# EAGLE design huskylens_servo (EAGLE 9.2.2)
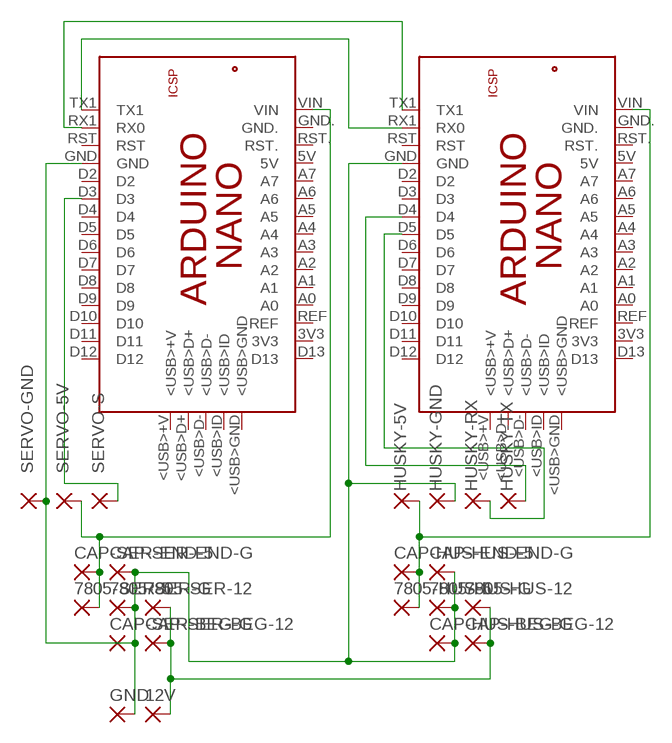
[diagram p0: schematic, sheet 1]

## Parts
12V  2,15/1,0  [2,15/1,0]
7805-HUS-5  2,15/1,0  [2,15/1,0]
7805-HUS-12  2,15/1,0  [2,15/1,0]
7805-HUS-G  2,15/1,0  [2,15/1,0]
7805-SER-5  2,15/1,0  [2,15/1,0]
7805-SER-12  2,15/1,0  [2,15/1,0]
7805-SER-G  2,15/1,0  [2,15/1,0]
CAP-HUS-BEG-12  2,15/1,0  [2,15/1,0]
CAP-HUS-BEG-G  2,15/1,0  [2,15/1,0]
CAP-HUS-END-5  2,15/1,0  [2,15/1,0]
CAP-HUS-END-G  2,15/1,0  [2,15/1,0]
CAP-SER-BEG-12  2,15/1,0  [2,15/1,0]
CAP-SER-BEG-G  2,15/1,0  [2,15/1,0]
CAP-SER-END-5  2,15/1,0  [2,15/1,0]
CAP-SER-END-G  2,15/1,0  [2,15/1,0]
GND  2,15/1,0  [2,15/1,0]
HUSKY-5V  2,15/1,0  [2,15/1,0]
HUSKY-ARD  ARDUINO_NANO  [ARDUINO_NANO]
HUSKY-GND  2,15/1,0  [2,15/1,0]
HUSKY-RX  2,15/1,0  [2,15/1,0]
HUSKY-TX  2,15/1,0  [2,15/1,0]
SERVO-5V  2,15/1,0  [2,15/1,0]
SERVO-ARD  ARDUINO_NANO  [ARDUINO_NANO]
SERVO-GND  2,15/1,0  [2,15/1,0]
SERVO-S  2,15/1,0  [2,15/1,0]

## Nets
N$1: HUSKY-ARD.RX1(RX0) SERVO-ARD.TX1
N$2: HUSKY-ARD.TX1 SERVO-ARD.RX1(RX0)
N$3: 7805-HUS-G.1(P) 7805-SER-G.1(P) CAP-HUS-BEG-G.1(P) CAP-HUS-END-G.1(P) CAP-SER-BEG-G.1(P) CAP-SER-END-G.1(P) GND.1(P) HUSKY-ARD.GND HUSKY-GND.1(P) SERVO-ARD.GND SERVO-GND.1(P)
N$4: HUSKY-ARD.D5 HUSKY-RX.1(P)
N$5: SERVO-ARD.D3 SERVO-S.1(P)
N$6: 12V.1(P) 7805-HUS-12.1(P) 7805-SER-12.1(P) CAP-HUS-BEG-12.1(P) CAP-SER-BEG-12.1(P)
N$7: 7805-HUS-5.1(P) CAP-HUS-END-5.1(P) HUSKY-5V.1(P) HUSKY-ARD.VIN
N$8: 7805-SER-5.1(P) CAP-SER-END-5.1(P) SERVO-5V.1(P) SERVO-ARD.VIN
N$9: HUSKY-ARD.D4 HUSKY-TX.1(P)
Unconnected: HUSKY-ARD.3V3 HUSKY-ARD.5V HUSKY-ARD.5V. HUSKY-ARD.<USB>+V HUSKY-ARD.<USB>D+ HUSKY-ARD.<USB>D- HUSKY-ARD.<USB>GND HUSKY-ARD.<USB>ID HUSKY-ARD.A0 HUSKY-ARD.A1 HUSKY-ARD.A2 HUSKY-ARD.A3 HUSKY-ARD.A4 HUSKY-ARD.A5 HUSKY-ARD.A6 HUSKY-ARD.A7 HUSKY-ARD.D2 HUSKY-ARD.D3 HUSKY-ARD.D6 HUSKY-ARD.D7 HUSKY-ARD.D8 HUSKY-ARD.D9 HUSKY-ARD.D10 HUSKY-ARD.D11 HUSKY-ARD.D12 HUSKY-ARD.D13 HUSKY-ARD.GND. HUSKY-ARD.GND_ HUSKY-ARD.MISO HUSKY-ARD.MOSI HUSKY-ARD.REF HUSKY-ARD.RESET.. HUSKY-ARD.RST HUSKY-ARD.RST. HUSKY-ARD.SCK SERVO-ARD.3V3 SERVO-ARD.5V SERVO-ARD.5V. SERVO-ARD.<USB>+V SERVO-ARD.<USB>D+ SERVO-ARD.<USB>D- SERVO-ARD.<USB>GND SERVO-ARD.<USB>ID SERVO-ARD.A0 SERVO-ARD.A1 SERVO-ARD.A2 SERVO-ARD.A3 SERVO-ARD.A4 SERVO-ARD.A5 SERVO-ARD.A6 SERVO-ARD.A7 SERVO-ARD.D2 SERVO-ARD.D4 SERVO-ARD.D5 SERVO-ARD.D6 SERVO-ARD.D7 SERVO-ARD.D8 SERVO-ARD.D9 SERVO-ARD.D10 SERVO-ARD.D11 SERVO-ARD.D12 SERVO-ARD.D13 SERVO-ARD.GND. SERVO-ARD.GND_ SERVO-ARD.MISO SERVO-ARD.MOSI SERVO-ARD.REF SERVO-ARD.RESET.. SERVO-ARD.RST SERVO-ARD.RST. SERVO-ARD.SCK

## Library data of the parts
12V 7805-HUS-5 7805-HUS-12 7805-HUS-G 7805-SER-5 7805-SER-12 7805-SER-G CAP-HUS-BEG-12 CAP-HUS-BEG-G CAP-HUS-END-5 CAP-HUS-END-G CAP-SER-BEG-12 CAP-SER-BEG-G CAP-SER-END-5 CAP-SER-END-G GND HUSKY-5V HUSKY-GND HUSKY-RX HUSKY-TX SERVO-5V SERVO-GND SERVO-S = wirepad:2,15/1,0: THROUGH-HOLE PAD
HUSKY-ARD SERVO-ARD = E14_Arduino_revC:ARDUINO_NANO: Device for representing an Arduino Nano board with a footprint in an EAGLE design. Created by Dave Young for Element14. More EAGLE documentation at: http://www.element14.com/community/community/knode/cadsoft_eagle

## Board
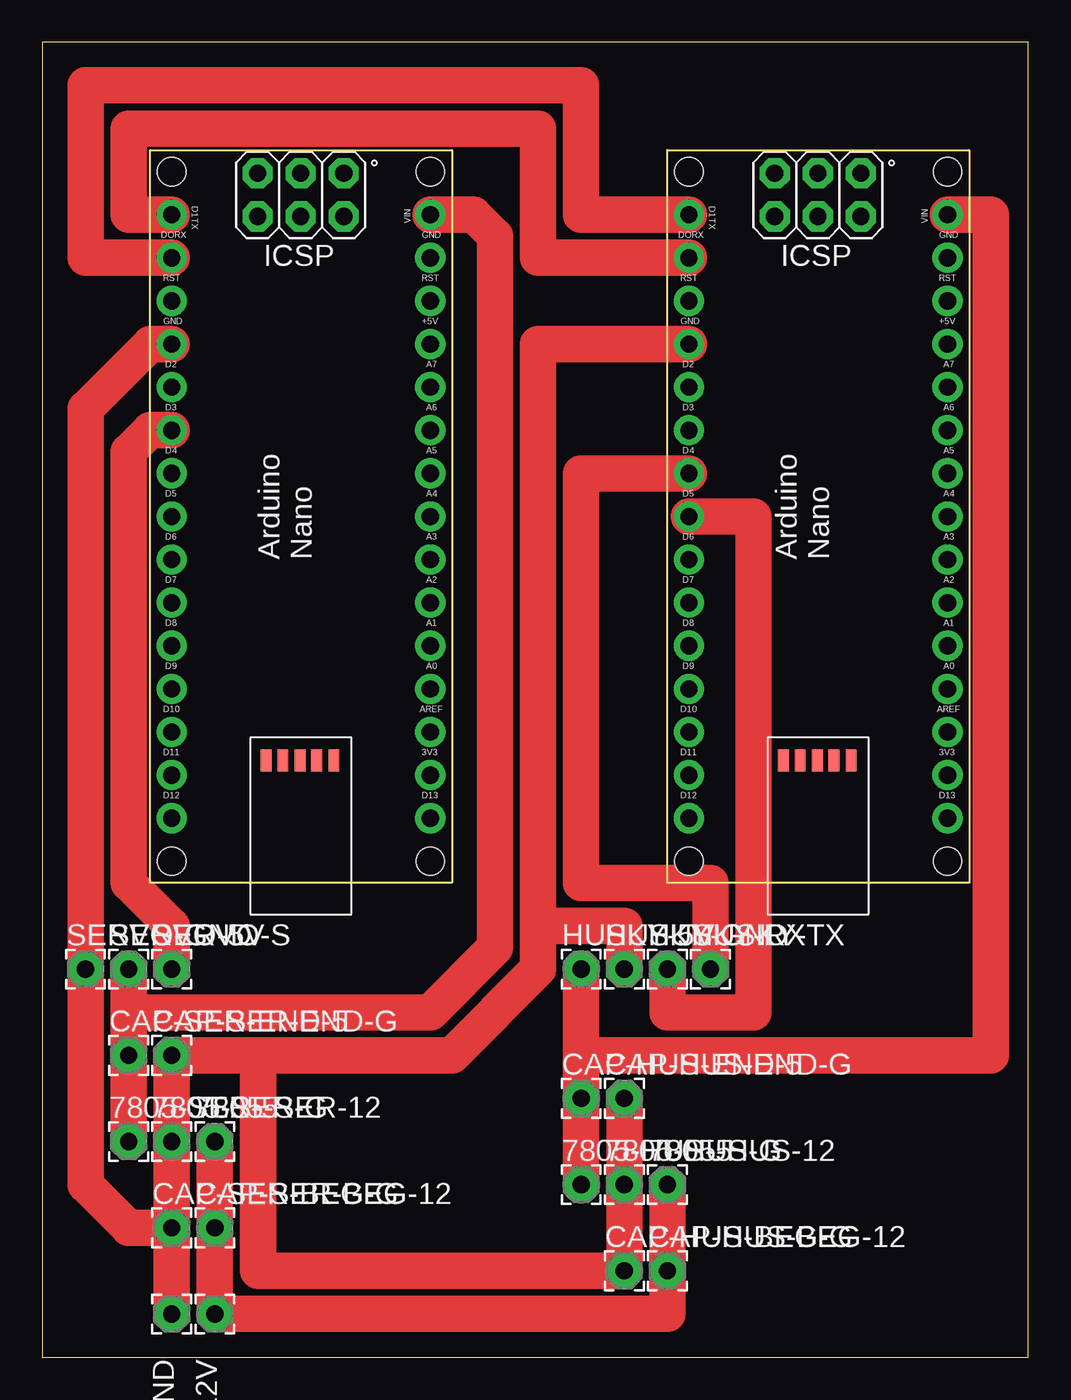
[diagram p1: board, top side]

Size 58.09 x 77.46 mm. Coordinates in mm from the lower left corner, seen from the top.
Outline: 0,0 58.09,0 58.09,77.46 0,77.46 0,0
Copper layers (1*16): Top 0.035mm / dielectric 1.5mm / Bottom 0.035mm
Design rules "default": minimum track width 6mil, minimum drill 0.35mm, track to track 6mil, track to pad 6mil, pad to pad 6mil, via to via 6mil, smd to smd 6mil, copper to edge 40mil, drill to drill 6mil, minimum pad ring 10mil, minimum via ring 8mil, stop-mask expansion 4mil, vias tented up to drill 0mil, thermal gap 10mil

### Footprints (pad centres in the part's own frame; a part is rotated, then mirrored left to right if it is on the bottom)
2,15/1,0 = drill 1.016 pad 2.159 octagon: 1 0,0
ARDUINO_NANO = drill 1.016 pad 1.778: 3V3 6.35,1.27; 5V 31.75,1.27; A0 11.43,1.27; A1 13.97,1.27; A2 16.51,1.27; A3 19.05,1.27; A4 21.59,1.27; A5 24.13,1.27; A6 26.67,1.27; A7 29.21,1.27; D2 29.21,16.51; D3 26.67,16.51; D4 24.13,16.51; D5 21.59,16.51; D6 19.05,16.51; D7 16.51,16.51; D8 13.97,16.51; D9 11.43,16.51; D10 8.89,16.51; D11 6.35,16.51; D12 3.81,16.51; D13 3.81,1.27; GND 31.75,16.51; GND. 36.83,1.27; REF 8.89,1.27; RST 34.29,16.51; RST. 34.29,1.27; RX1 36.83,16.51; TX1 39.37,16.51; VIN 39.37,1.27 | drill 1.016 pad 1.778 octagon: 5V. 39.268,6.375; GND_ 39.268,11.455; MISO 41.808,6.375; MOSI 39.268,8.915; RESET.. 41.808,11.455; SCK 41.808,8.915 | smd 1.27 x 0.635: <USB>+V 7.214,10.947; <USB>D+ 7.214,9.957; <USB>D- 7.214,8.941; <USB>GND 7.214,6.96; <USB>ID 7.214,7.976 | hole 1.651: 1.27,1.27; 1.27,16.51; 41.91,16.51; 41.91,1.27

### Placement (x,y rotation side)
12V  10.16,2.54 0 top
7805-HUS-5  31.75,10.16 0 top
7805-HUS-12  36.83,10.16 0 top
7805-HUS-G  34.29,10.16 0 top
7805-SER-5  5.08,12.7 0 top
7805-SER-12  10.16,12.7 0 top
7805-SER-G  7.62,12.7 0 top
CAP-HUS-BEG-12  36.83,5.08 0 top
CAP-HUS-BEG-G  34.29,5.08 0 top
CAP-HUS-END-5  31.75,15.24 0 top
CAP-HUS-END-G  34.29,15.24 0 top
CAP-SER-BEG-12  10.16,7.62 0 top
CAP-SER-BEG-G  7.62,7.62 0 top
CAP-SER-END-5  5.08,17.78 0 top
CAP-SER-END-G  7.62,17.78 0 top
GND  7.62,2.54 0 top
HUSKY-5V  31.75,22.86 0 top
HUSKY-ARD  54.61,27.94 90 top
HUSKY-GND  34.29,22.86 0 top
HUSKY-RX  36.83,22.86 0 top
HUSKY-TX  39.37,22.86 0 top
SERVO-5V  5.08,22.86 0 top
SERVO-ARD  24.13,27.94 90 top
SERVO-GND  2.54,22.86 0 top
SERVO-S  7.62,22.86 0 top

### Tracks (layer width: path | path; a pad name or v marks a point on that pad's centre or on a via)
N$1
  Top 2.15: SERVO-ARD.TX1 5.08,67.31 5.08,72.39 29.21,72.39 29.21,64.77 HUSKY-ARD.RX1
N$2
  Top 2.15: SERVO-ARD.RX1 2.54,64.77 2.54,74.93 31.75,74.93 31.75,67.31 HUSKY-ARD.TX1
N$3
  Top 2.15: GND.1 CAP-SER-BEG-G.1 | CAP-SER-BEG-G.1 7805-SER-G.1 CAP-SER-END-G.1 12.7,17.78 | CAP-SER-BEG-G.1 5.08,7.62 2.54,10.16 SERVO-GND.1 2.54,55.88 6.35,59.69 SERVO-ARD.GND | HUSKY-ARD.GND 29.21,59.69 29.21,25.4 | 29.21,25.4 29.21,22.86 24.13,17.78 12.7,17.78 | 12.7,17.78 12.7,5.08 CAP-HUS-BEG-G.1 7805-HUS-G.1 CAP-HUS-END-G.1 | HUSKY-GND.1 34.29,25.4 29.21,25.4
N$4
  Top 2.15: HUSKY-RX.1 36.83,20.32 41.91,20.32 41.91,49.53 HUSKY-ARD.D5
N$5
  Top 2.15: SERVO-ARD.D3 6.35,54.61 5.08,53.34 5.08,27.94 7.62,25.4 SERVO-S.1
N$6
  Top 2.15: 7805-SER-12.1 CAP-SER-BEG-12.1 12V.1 36.83,2.54 CAP-HUS-BEG-12.1 7805-HUS-12.1
N$7
  Top 2.15: 7805-HUS-5.1 CAP-HUS-END-5.1 31.75,17.78 | 31.75,17.78 55.88,17.78 55.88,67.31 HUSKY-ARD.VIN | HUSKY-5V.1 31.75,17.78
N$8
  Top 2.15: 7805-SER-5.1 CAP-SER-END-5.1 5.08,20.32 | 5.08,20.32 SERVO-5V.1 | 5.08,20.32 22.86,20.32 26.67,24.13 26.67,66.04 25.4,67.31 SERVO-ARD.VIN
N$9
  Top 2.15: HUSKY-TX.1 39.37,27.94 31.75,27.94 31.75,52.07 HUSKY-ARD.D4